# Altium schematic sheet _gyroscope.SchDoc
size Tabloid
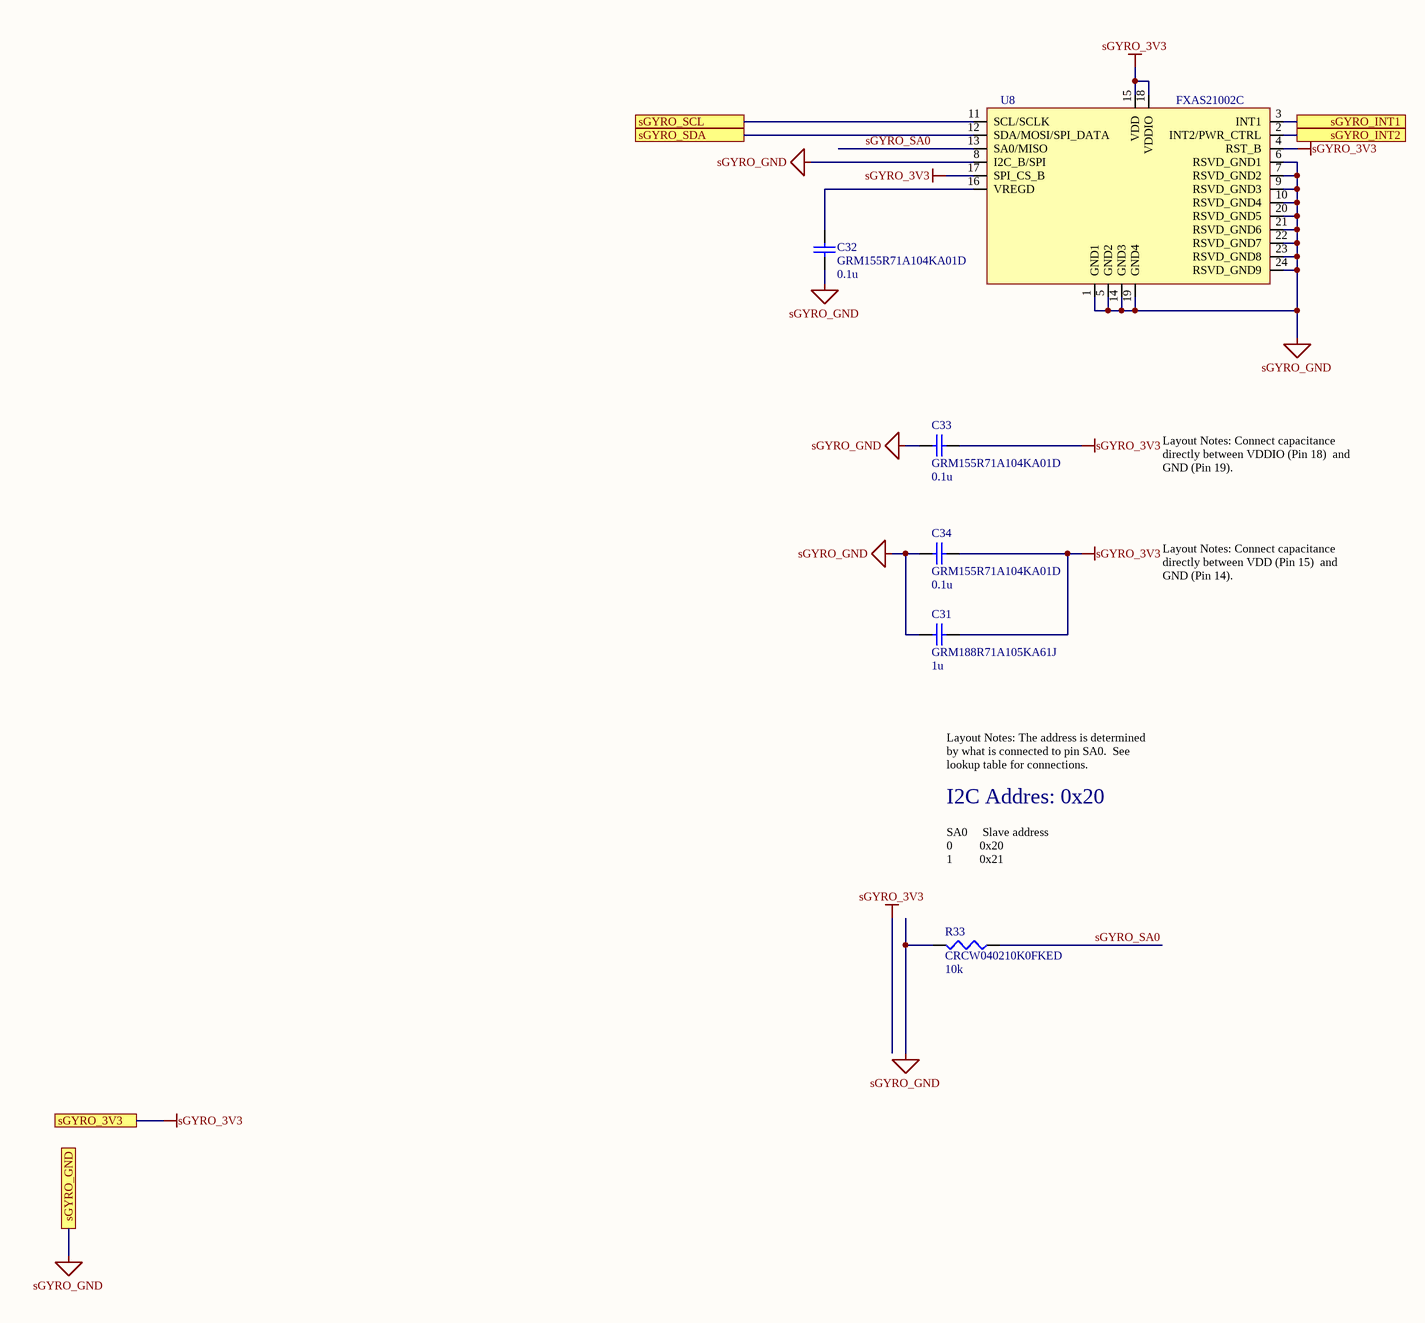
[diagram p0: _gyroscope.SchDoc]

## Parts
C31  GRM188R71A105KA61J  value 1u  [0603]
C32  GRM155R71A104KA01D  value 0.1u  [0402]
C33  GRM155R71A104KA01D  value 0.1u  [0402]
C34  GRM155R71A104KA01D  value 0.1u  [0402]
R33  CRCW040210K0FKED  value 10k  [0402]
U8  FXAS21002C  [SMD QFN 24_4X4MM 7/5]

## Ports
sGYRO_3V3, sGYRO_GND, sGYRO_INT1, sGYRO_INT2, sGYRO_SCL, sGYRO_SDA

## Nets
sGYRO_3V3: C31.1 C33.2 C34.2 U8.4(RST_B) U8.15(VDD) U8.17(SPI_CS_B) U8.18(VDDIO) ; port sGYRO_3V3
sGYRO_GND: C31.2 C32.2 C33.1 C34.1 R33.2 U8.1(GND1) U8.5(GND2) U8.6(RSVD_GND1) U8.7(RSVD_GND2) U8.8(I2C_B/SPI) U8.9(RSVD_GND3) U8.10(RSVD_GND4) U8.14(GND3) U8.19(GND4) U8.20(RSVD_GND5) U8.21(RSVD_GND6) U8.22(RSVD_GND7) U8.23(RSVD_GND8) U8.24(RSVD_GND9) ; port sGYRO_GND
sGYRO_INT1: U8.3(INT1) ; port sGYRO_INT1
sGYRO_INT2: U8.2(INT2/PWR_CTRL) ; port sGYRO_INT2
sGYRO_SA0: R33.1 U8.13(SA0/MISO)
sGYRO_SCL: U8.11(SCL/SCLK) ; port sGYRO_SCL
sGYRO_SDA: U8.12(SDA/MOSI/SPI_DATA) ; port sGYRO_SDA
NetC32_1: C32.1 U8.16(VREGD)

## Notes on the sheet
- Layout Notes: Connect capacitance directly between VDDIO (Pin 18)  and GND (Pin 19).
- Layout Notes: Connect capacitance directly between VDD (Pin 15)  and GND (Pin 14).
- Layout Notes: The address is determined by what is connected to pin SA0.  See lookup table for connections.
- I2C Addres: 0x20
- SA0     Slave address
  0         0x20
  1         0x21

## Library data of the parts
C31 = GRM188R71AxxxKdddd: -55-125C, 1608, 10V, X7R, ±10%
C32-C34 = GRM155R71AxxxKdddd: -55-125C, 1005, 10V, X7R, ±10%
R33 = CRCW0402xxxxFKED: 0.125W, -55-155C, 1005, 50V, ±1%
U8 = FXAS21002C: 3-Axis Digital Angular Rate  Gyroscope